# EAGLE design AD_IanFritz_CONTROLS (EAGLE 9.6.2)
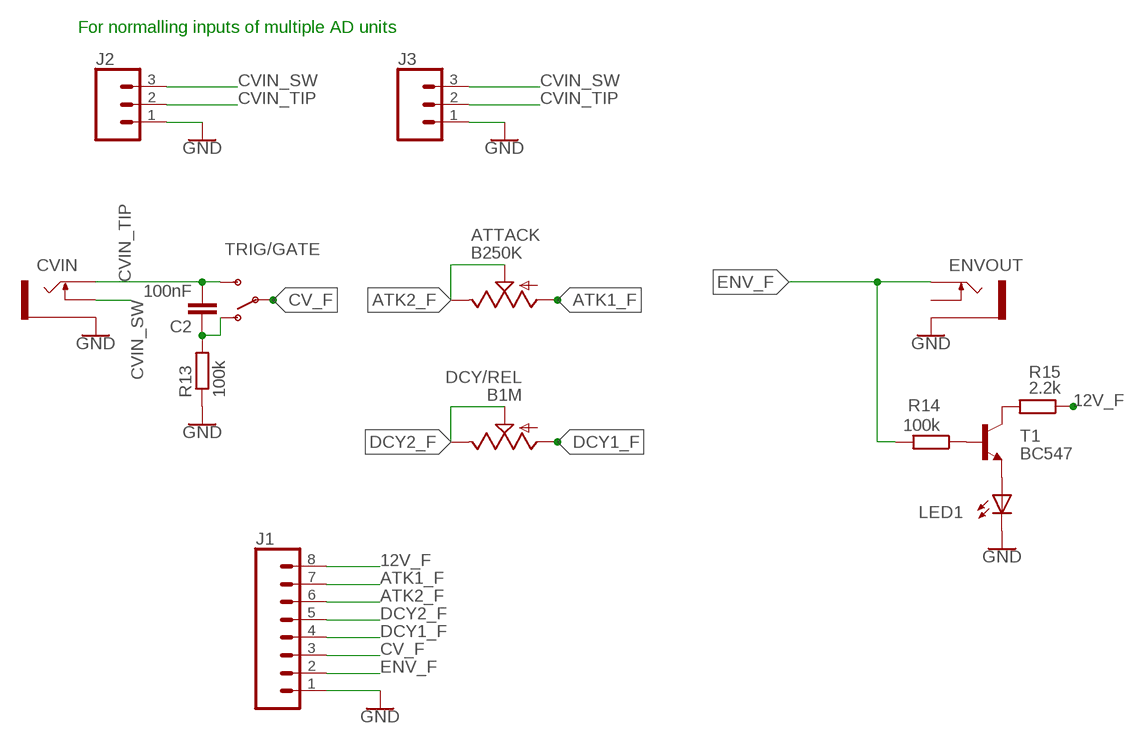
[diagram p0: schematic, sheet 1]

## Parts
ATTACK  B250K  9MM_SNAP-IN_POT_  [9MM_SNAP-IN_POT]
C2  100nF  C2,5-3  [C2.5-3]
CVIN  THONKICONNNEW  [WQP-PJ301M-12_JACK]
DCY/REL  B1M  9MM_SNAP-IN_POT_  [9MM_SNAP-IN_POT]
ENVOUT  THONKICONNNEW  [WQP-PJ301M-12_JACK]
J1  CONN_08"  [1X08]
J2  CONN_031X03_NO_SILK  [1X03_NO_SILK]
J3  CONN_031X03_NO_SILK  [1X03_NO_SILK]
LED1  LED3MM  [LED3MM]
R13  100k  RESISTOR7MM  [7MM_RESISTOR]
R14  100k  RESISTOR7MM  [7MM_RESISTOR]
R15  2.2k  RESISTOR7MM  [7MM_RESISTOR]
T1  BC547  [TO92]
TRIG/GATE  SUBMINI_SPDT  [SUBMINI_TOGGLE]

## Nets
12V_F: J1.8 R15.1
ATK1_F: ATTACK.1(A) J1.7
ATK2_F: ATTACK.2(S) ATTACK.3(E) J1.6
CV_F: J1.3 TRIG/GATE.COM(COMMON)
CVIN_SW: CVIN.P$2_SWITCH(SWITCH) J2.3 J3.3
CVIN_TIP: C2.2 CVIN.P$1_TIP(TIP) J2.2 J3.2 TRIG/GATE.3(S)
DCY1_F: DCY/REL.1(A) J1.4
DCY2_F: DCY/REL.2(S) DCY/REL.3(E) J1.5
ENV_F: ENVOUT.P$1_TIP(TIP) J1.2 R14.2
GND: CVIN.P$3_SLEEVE(SLEEVE) ENVOUT.P$3_SLEEVE(SLEEVE) J1.1 J2.1 J3.1 LED1.K(C) R13.1
N$5: C2.1 R13.2 TRIG/GATE.1(O)
N$21: LED1.A T1.1(E)
N$22: R14.1 T1.2(B)
N$23: R15.2 T1.3(C)
Unconnected: ENVOUT.P$2_SWITCH(SWITCH)

## Notes on the sheet
- For normalling inputs of multiple AD units

## Library data of the parts
ATTACK DCY/REL = MusicThingModular:9MM_SNAP-IN_POT: 9mm vertical snap-in pot, Alpha / Panasonic style
C2 = capacitor-wima:C: CAPACITOR naming: grid - package width
CVIN ENVOUT = MusicThingModular:THONKICONN: 3.5mm socket for Eurorack modular synths
J1 = SparkFun-Connectors:CONN_08: Multi connection point. Often used as Generic Header-pin footprint for 0.1 inch spaced/style header connections On any of the 0.1 inch spaced packages, you can populate with these: Break Away Headers - Straight <https://www.sparkfun.com/products/116> (PRT-00116) Break Away Male Headers - Right Angle <https://www.sparkfun.com/products/553> (PRT-00553) Female Headers <https://www.sparkfun.com/products/115> (PRT-00115) Break Away Headers - Machine Pin <https://www.sparkfun.com/products/117> (PRT-00117) Break Away Female Headers - Swiss Machine Pin <https://www.sparkfun.com/products/743> (PRT-00743) Arduino Stackable Header - 8 Pin <https://www.sparkfun.com/products/9279> (PRT-09279) For SCREWTERMINALS and SPRING TERMINALS visit here: Screw Terimnals on SparkFun.com <https://www.sparkfun.com/search/results?term=Screw+Terminals> (5mm/3.5mm/2.54mm spacing) This device is also useful as a general connection point to wire up your design to another part of your project. Our various solder wires solder well into these plated through hole pads. Hook-Up Wire - Assortment (Stranded, 22 AWG) <https://www.sparkfun.com/products/11375> (PRT-11375) Hook-Up Wire - Assortment (Solid Core, 22 AWG) <https://www.sparkfun.com/products/11367> (PRT-11367) View the entire wire category on our website here <https://www.sparkfun.com/categories/141> Special notes: Molex polarized connector foot print use with SKU : PRT-08231 with associated crimp pins and housings. 1MM SMD Version SKU: PRT-10208 NOTES ON THE VARIANTS LOCK and LOCK_LONGPADS... This footprint was designed to help hold the alignment of a through-hole component (i.e. 6-pin header) while soldering it into place. You may notice that each hole has been shifted either up or down by 0.005 of an inch from it's more standard position (which is a perfectly straight line). This slight alteration caused the pins (the squares in the middle) to touch the edges of the holes. Because they are alternating, it causes a "brace" to hold the component in place. 0.005 has proven to be the perfect amount of "off-center" position when using our standard breakaway headers. Although looks a little odd when you look at the bare footprint, once you have a header in there, the alteration is very hard to notice. Also,if you push a header all the way into place, it is covered up entirely on the bottom side.; PROD_ID: CONN-08438
J2 J3 = SparkFun-Connectors:CONN_03: Multi connection point. Often used as Generic Header-pin footprint for 0.1 inch spaced/style header connections On any of the 0.1 inch spaced packages, you can populate with these: Break Away Headers - Straight <https://www.sparkfun.com/products/116> (PRT-00116) Break Away Male Headers - Right Angle <https://www.sparkfun.com/products/553> (PRT-00553) Female Headers <https://www.sparkfun.com/products/115> (PRT-00115) Break Away Headers - Machine Pin <https://www.sparkfun.com/products/117> (PRT-00117) Break Away Female Headers - Swiss Machine Pin <https://www.sparkfun.com/products/743> (PRT-00743) Stackable Header - 3 Pin (Female, 0.1") <https://www.sparkfun.com/products/13875> (PRT-13875) For SCREWTERMINALS and SPRING TERMINALS visit here: Screw Terimnals on SparkFun.com <https://www.sparkfun.com/search/results?term=Screw+Terminals> (5mm/3.5mm/2.54mm spacing) This device is also useful as a general connection point to wire up your design to another part of your project. Our various solder wires solder well into these plated through hole pads. Hook-Up Wire - Assortment (Stranded, 22 AWG) <https://www.sparkfun.com/products/11375> (PRT-11375) Hook-Up Wire - Assortment (Solid Core, 22 AWG) <https://www.sparkfun.com/products/11367> (PRT-11367) View the entire wire category on our website here <https://www.sparkfun.com/categories/141> Special notes: Molex polarized connector foot print use with SKU : PRT-08232 with associated crimp pins and housings.
LED1 = zlob:LED
R13-R15 = MusicThingModular:RESISTOR: Standard resistor, various versions
T1 = transistor:BC547: NPN TRANSISTOR
TRIG/GATE = MusicThingModular:SUBMINI_SPDT

## Net classes
0 default: width 0.203 mm
1 power: width 0.406 mm

## Board
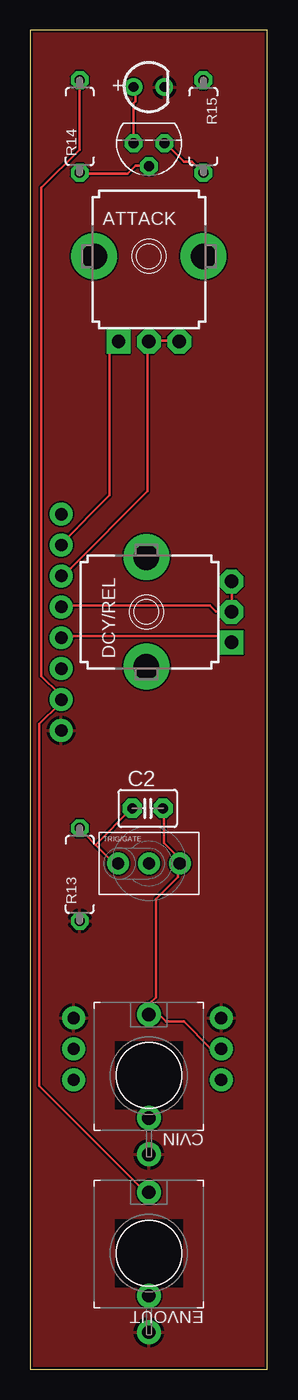
[diagram p1: board, top side]
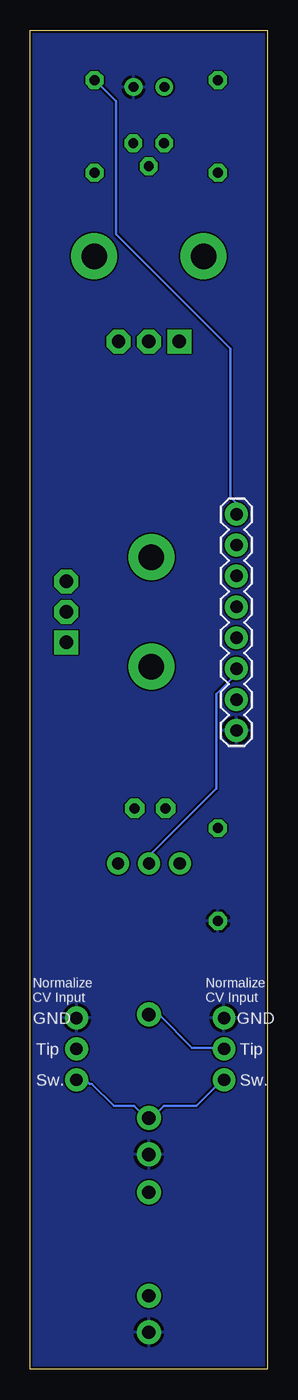
[diagram p2: board, bottom side, seen from below]

Size 19.5 x 110 mm. Coordinates in mm from the lower left corner, seen from the top.
Outline: 0,0 19.5,0 19.5,110 0,110 0,0
Copper layers (1*16): Top 0.035mm / dielectric 1.6mm / Bottom 0.035mm
Design rules "jlcpcb-2layers": minimum track width 5mil, minimum drill 0.3mm, track to track 5mil, track to pad 5mil, pad to pad 5mil, via to via 5mil, smd to smd 5mil, copper to edge 0.2mm, drill to drill 6mil, minimum pad ring 10mil, minimum via ring 3mil, stop-mask expansion 4mil, vias tented up to drill 0mil, thermal gap 10mil

### Footprints (pad centres in the part's own frame; a part is rotated, then mirrored left to right if it is on the bottom)
9MM_SNAP-IN_POT = drill 1.1 square: 1 -2.5,-7 | drill 1.1 octagon: 2 0,-7; 3 2.5,-7 | drill 2.1 pad 2.794: CHASSIS1 -4.5,0; CHASSIS2 4.5,0
C2.5-3 = drill 0.813 pad 1.6 octagon: 1 -1.27,0; 2 1.27,0
WQP-PJ301M-12_JACK = drill 1.1: P$1_TIP 0,5; P$2_SWITCH 0,-3.5; P$3_SLEEVE 0,-6.5
1X08 = drill 1.016 pad 1.88: 1 0,0; 2 2.54,0; 3 5.08,0; 4 7.62,0; 5 10.16,0; 6 12.7,0; 7 15.24,0; 8 17.78,0
1X03_NO_SILK = drill 1.016 pad 1.88: 1 0,0; 2 2.54,0; 3 5.08,0
LED3MM = drill 0.813: A -1.27,0; K 1.27,0
7MM_RESISTOR = drill 0.813 octagon: 1 -3.81,0; 2 3.81,0
TO92 = drill 0.813 octagon: 1 1.27,0; 2 0,1.905; 3 -1.27,0
SUBMINI_TOGGLE = drill 1 pad 1.422: 1 -2.54,0; 3 2.54,0; COM 0,0

### Placement (x,y rotation side)
ATTACK  9.75,91.44 0 top
C2  9.65,46.08 0 top
CVIN  9.75,24.13 0 top
DCY/REL  9.55,62.22 90 top
ENVOUT  9.75,9.52 0 top
J1  2.54,52.47 90 bottom
J2  3.56,28.85 270 bottom
J3  15.7,28.85 270 bottom
LED1  9.75,105.35 0 top
R13  4.06,40.64 90 top
R14  4.06,102.11 90 top
R15  14.22,102.11 270 top
T1  9.76,100.74 180 top
TRIG/GATE  9.75,41.55 0 top

### Tracks (layer width: path | path; a pad name or v marks a point on that pad's centre or on a via)
12V_F
  Bottom 0.203: R15.1 14.11,105.83 12.46,104.17 12.46,93.28 3.05,83.87 3.05,71.65 2.56,71.15 2.56,70.33 J1.8
ATK1_F
  Top 0.203: J1.7 2.56,67.85 6.52,71.81 6.52,83.7 7.18,84.36 ATTACK.1
ATK2_F
  Top 0.203: J1.6 2.56,65.21 3.05,65.7 3.22,65.7 9.66,72.14 9.66,84.36 ATTACK.2 9.82,84.53 12.13,84.53 ATTACK.3
CV_F
  Bottom 0.203: TRIG/GATE.COM 9.66,41.6 9.66,42.26 4.21,47.71 4.21,55.47 2.56,57.12 2.56,57.45 J1.3
CVIN_SW
  Bottom 0.203: J2.3 3.71,23.77 5.86,21.62 8.5,21.62 9.66,20.47 CVIN.P$2_SWITCH 9.82,20.47 10.98,21.62 12.63,21.62 14.44,23.44 14.61,23.44 14.94,23.77 J3.3
CVIN_TIP
  Top 0.203: C2.2 10.98,46.06 10.98,43.25 12.13,42.1 12.13,41.6 TRIG/GATE.3 12.13,41.44 12.13,40.45 10.32,38.63 10.32,30.54 9.82,30.04 9.82,29.22 CVIN.P$1_TIP 9.82,29.05 10.65,29.05 11.14,28.56 12.63,28.56 14.77,26.41 15.6,26.41 J3.2
  Bottom 0.203: J2.2 3.71,26.41 6.19,26.41 8.83,29.05 9.66,29.05 CVIN.P$1_TIP
DCY1_F
  Top 0.203: J1.4 3.38,60.09 3.55,60.26 15.93,60.26 16.43,59.76 DCY/REL.1
DCY2_F
  Top 0.203: J1.5 2.56,62.73 14.77,62.73 15.27,62.24 16.43,62.24 DCY/REL.2 16.59,62.24 16.59,64.72 DCY/REL.3
ENV_F
  Top 0.203: R14.2 4.04,105.83 4.04,100.21 0.91,97.07 0.91,56.95 2.39,55.47 2.39,55.14 J1.2 2.39,54.97 2.39,54.64 0.74,52.99 0.74,23.27 9.33,14.69 9.66,14.69 ENVOUT.P$1_TIP
GND
  pour Top: -2.79,111.4 22.61,111.4 23.12,110.89 23.12,-2.39 22.86,-2.65 -2.79,-2.65
  pour Bottom: -2.79,111.4 23.63,111.4 23.63,-0.87 25.4,-2.65 -1.27,-2.65 -1.77,-3.15 -1.77,109.62 -2.54,110.38 -2.79,110.64 -3.04,110.64 -2.79,110.89
N$5
  Top 0.203: 5.36,43.09 6.85,41.6 7.18,41.6 TRIG/GATE.1 | 5.36,43.09 4.54,43.91 4.54,44.08 4.21,44.41 R13.2 | 5.36,43.09 8.34,46.06 C2.1
N$21
  Top 0.203: T1.1 8.5,100.87 8.5,104.01 8.66,104.17 8.66,105.16 8.5,105.33 LED1.A
N$22
  Top 0.203: R14.1 4.21,98.23 8.01,98.23 8.66,98.89 9.66,98.89 T1.2
N$23
  Top 0.203: T1.3 11.14,100.71 12.63,99.22 13.29,99.22 14.11,98.39 R15.2

### Text on the board
bPlace: Normalize / CV Input | Normalize / CV Input | GND | GND | Tip | Tip | Sw. | Sw.